# Altium project fuenteRegulada.PrjPCB
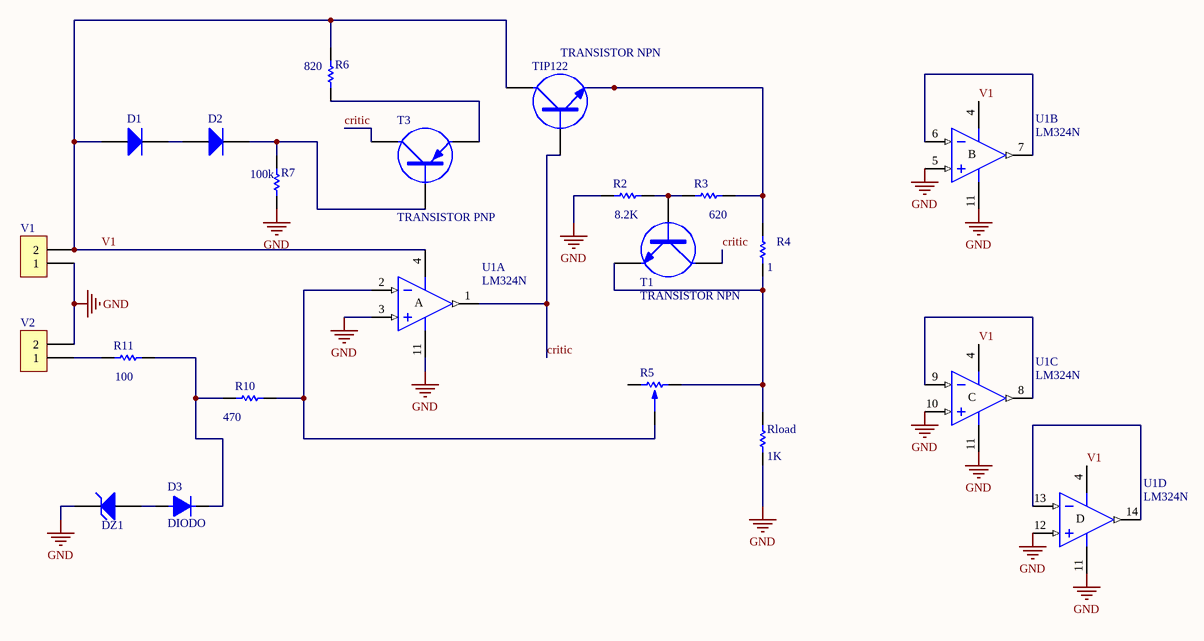
[diagram p0: fuenteRegulada.SchDoc]
1 sheet, 19 parts. Net scope: global (net labels, ports and power ports of the same name join across sheets).
Board file: fuenteRegulada.PcbDoc

## Sheet fuenteRegulada.SchDoc
size Letter

### Parts
D1  Diode 1N914  [DO-35]  (value not drawn)
D2  Diode 1N914  [DO-35]  (value not drawn)
D3  DIODO  [DO41]
DZ1  D Zener  [DIODE-0.7]  (value not drawn)
R2  value 8.2K  [AXIAL-0.3]  (hidden comment: Res1)
R3  value 620  [AXIAL-0.3]  (hidden comment: Res1)
R4  value 1  [AXIAL-0.3]  (hidden comment: Res1)
R5  PRESET  [PRESET V]  (value not drawn)
R6  value 820  [AXIAL-0.3]  (hidden comment: Res1)
R7  value 100k  [AXIAL-0.3]  (hidden comment: Res1)
R10  value 470  [AXIAL-0.3]  (hidden comment: Res1)
R11  value 100  [AXIAL-0.3]  (hidden comment: Res1)
Rload  value 1K  [AXIAL-0.3]  (hidden comment: Res1)
T1  TRANSISTOR NPN  [TO92]
T3  TRANSISTOR PNP  [TO92]
TIP122  TRANSISTOR NPN  [TO-220 H]
U1  LM324N  [N014]  (parts A,B,C,D of 4)
V1  BORNERA 2  [BORNERA2]  (value not drawn)
V2  BORNERA 2  [BORNERA2]  (value not drawn)

### Nets
GND: DZ1.2(K) R2.2 R7.1 Rload.1 U1.3(IN+) U1.5(IN+) U1.10(IN+) U1.11(V-) U1.12(IN+) V1.1 V2.2
critic: T1.2(C) T3.2(C) TIP122.1(B) U1.1(OUT)
V1: D1.1(A) R6.2 TIP122.2(C) U1.4(V+) V1.2
NetD1_2: D1.2(K) D2.1(A)
NetD2_2: D2.2(K) R7.2 T3.1(B)
NetD3_1: D3.1 DZ1.1(A)
NetD3_2: D3.2 R10.1 R11.2
NetR2_1: R2.1 R3.2 T1.1(B)
NetR3_1: R3.1 R4.1 TIP122.3(E)
NetR4_2: R4.2 R5.1 Rload.2 T1.3(E)
NetR5_2: R5.2 R10.2 U1.2(IN-)
NetR6_1: R6.1 T3.3(E)
NetR11_1: R11.1 V2.1
NetU1_6: U1.6(IN-) U1.7(OUT)
NetU1_8: U1.8(OUT) U1.9(IN-)
NetU1_13: U1.13(IN-) U1.14(OUT)

Not connected (* = marked no-connect by the designer): R5 3

### Notes on the sheet
- (in symbol LM324N, part A) A
- (in symbol LM324N, part B) B
- (in symbol LM324N, part C) C
- (in symbol LM324N, part D) D

### Library data of the parts
D1 D2 = Diode 1N914: High Conductance Fast Diode; Published: 8-Jun-2000; LatestRevisionDate: 17-Jul-2002; LatestRevisionNote: Re-released for DXP Platform.; DatasheetVersion: 1997; PackageReference: DO-35; Publisher: Altium Limited; PackageDescription: Diode, Axial; Body 3.8 x 1.9 mm (LxDia. max), Lead Dia. 0.53 mm (max); Code_JEDEC: DO-204-AH; ComponentLink1Description: Manufacturer Link; ComponentLink1URL: http://www.fairchildsemi.com/; ComponentLink2Description: Datasheet; ComponentLink2URL: http://www.fairchildsemi.com/ds/1N%2F1N4448.pdf
DZ1 = D Zener: Zener Diode; Published: 8-Jun-2000; LatestRevisionDate: 17-Jul-2002; LatestRevisionNote: Re-released for DXP Platform.; PackageReference: DIODE-0.7; Publisher: Altium Limited; PackageDescription: Diode, Thru-Hole; 2 Leads; 0.7 in Pin Spacing
R2-R4 R6 R7 R10 R11 Rload = Res1: Resistor; Published: 8-Jun-2000; LatestRevisionDate: 17-Jul-2002; LatestRevisionNote: Re-released for DXP Platform.; PackageReference: AXIAL-0.3; Publisher: Altium Limited; PackageDescription: Axial Device, Thru-Hole; 2 Leads; 0.3 in Pin Spacing
U1 = LM324N: Quadruple Operational Amplifier; Published: 16-Jan-2001; LatestRevisionDate: 04-Mar-2005; LatestRevisionNote: Stylized 3D Model Added.; DatasheetVersion: Feb-1997; PackageVersion: Oct-1995; PackageReference: N014; Publisher: Altium Limited; PackageDescription: DIP; 14 Leads; Row Spacing 7.62 mm; Pitch 2.54 mm; ComponentLink1Description: Manufacturer Link; ComponentLink1URL: http://www.ti.com/; ComponentLink2Description: Datasheet; ComponentLink2URL: http://www-s.ti.com/sc/ds/lm324.pdf